# EAGLE schematic design (EAGLE 9.5.2)
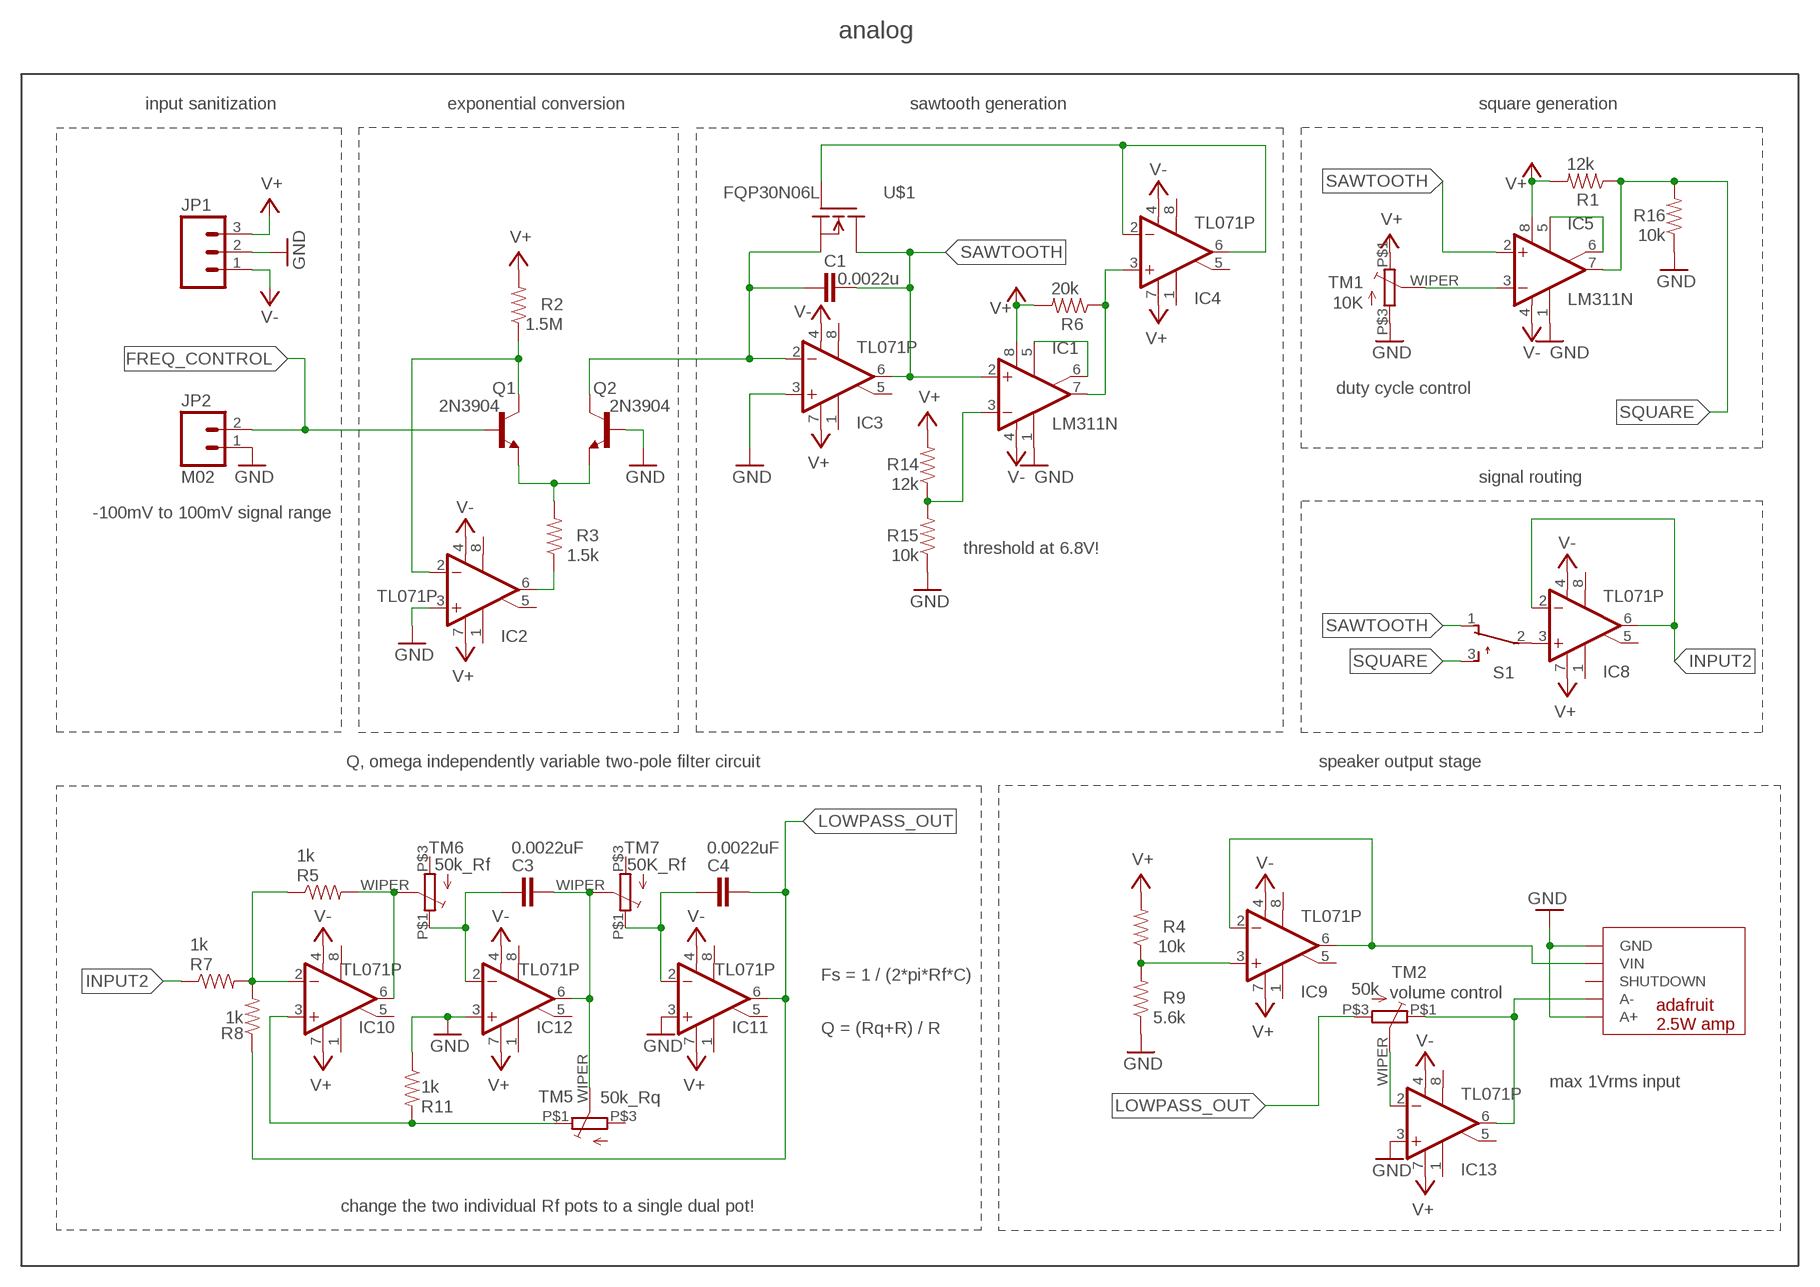
[diagram p0: schematic, sheet 1]

## Parts
C1  0.0022u  CAPCAP_WIMA  [3872_WIMA_CAP]
C3  0.0022uF  CAPPTH1  [CAP-PTH-5MM]
C4  0.0022uF  CAPPTH1  [CAP-PTH-5MM]
IC1  LM311N  [DIL08]
IC2  TL071P  [DIL08]
IC3  TL071P  [DIL08]
IC4  TL071P  [DIL08]
IC5  LM311N  [DIL08]
IC8  TL071P  [DIL08]
IC9  TL071P  [DIL08]
IC10  TL071P  [DIL08]
IC11  TL071P  [DIL08]
IC12  TL071P  [DIL08]
IC13  TL071P  [DIL08]
JP1  M03  [1X03]
JP2  M02  [1X02]
Q1  2N3904  [TO92]
Q2  2N3904  [TO92]
R1  12k  RESISTORAXIAL-0.3  [AXIAL-0.3]
R2  1.5M  RESISTORAXIAL-0.3  [AXIAL-0.3]
R3  1.5k  RESISTORAXIAL-0.3  [AXIAL-0.3]
R4  10k  RESISTORAXIAL-0.3  [AXIAL-0.3]
R5  1k  RESISTORAXIAL-0.3  [AXIAL-0.3]
R6  20k  RESISTORAXIAL-0.3  [AXIAL-0.3]
R7  1k  RESISTORAXIAL-0.3  [AXIAL-0.3]
R8  1k  RESISTORAXIAL-0.3  [AXIAL-0.3]
R9  5.6k  RESISTORAXIAL-0.3  [AXIAL-0.3]
R11  1k  RESISTORAXIAL-0.3  [AXIAL-0.3]
R14  12k  RESISTORAXIAL-0.3  [AXIAL-0.3]
R15  10k  RESISTORAXIAL-0.3  [AXIAL-0.3]
R16  10k  RESISTORAXIAL-0.3  [AXIAL-0.3]
S1  TL32PO  [TL3XPO]
TM1  10K  TRIMPOT  [3386_TRI]
TM2  50k  TRIMPOT  [3386_TRI]
TM5  50k_Rq  TRIMPOT  [3386_TRI]
TM6  50k_Rf  TRIMPOT  [3386_TRI]
TM7  50K_Rf  TRIMPOT  [3386_TRI]
U$1  FQP30N06L  [TO-220]
U$2  PAM8302A_ADAFRUIT  [PAM8302A_ADAFRUIT]

## Nets
11.5V: IC9.3(+IN) R4.P$1 R9.P$2
BANDPASS_OUT: C3.1 IC12.6(OUT) TM5.WIPER(S) TM7.WIPER(S)
FREQ_CONTROL: JP2.2 Q1.2(B)
GND: IC1.1(GND) IC2.3(+IN) IC3.3(+IN) IC5.1(GND) IC11.3(+IN) IC12.3(+IN) IC13.3(+IN) JP1.2 JP2.1 Q2.2(B) R9.P$1 R11.P$1 R15.P$1 R16.P$1 TM1.P$3(A) U$2.A+ U$2.GND
HIGHPASS_OUT: IC10.6(OUT) R5.P$2 TM6.WIPER(S)
INPUT2: IC8.2(-IN) IC8.6(OUT) R7.P$1
LOWPASS_OUT: C4.1 IC11.6(OUT) R8.P$1 TM2.P$3(A)
N$1: IC5.3(-IN) TM1.WIPER(S)
N$2: Q1.3(E) Q2.3(E) R3.P$2
N$4: IC13.2(-IN) TM2.WIPER(S)
N$5: IC2.6(OUT) R3.P$1
N$6: IC1.7(OUT) IC4.3(+IN) R6.P$1
N$7: C1.P$1 IC3.2(-IN) Q2.1(C) U$1.3(S)
N$9: IC1.5(ON) IC1.6(ON/STR)
N$10: IC4.2(-IN) IC4.6(OUT) U$1.1(G)
N$11: IC5.5(ON) IC5.6(ON/STR)
N$12: IC2.2(-IN) Q1.1(C) R2.P$1
N$18: IC10.2(-IN) R5.P$1 R7.P$2 R8.P$2
N$19: IC13.6(OUT) TM2.P$1(E) U$2.A-
N$20: C3.2 IC12.2(-IN) TM6.P$1(E)
N$22: C4.2 IC11.2(-IN) TM7.P$1(E)
N$24: IC1.3(-IN) R14.P$1 R15.P$2
N$25: IC10.3(+IN) R11.P$2 TM5.P$1(E)
PRE_FILTER: IC8.3(+IN) S1.2(P)
SAWTOOTH: C1.P$5 IC1.2(+IN) IC3.6(OUT) IC5.2(+IN) S1.1(O) U$1.2(D)
SQUARE: IC5.7(OUT) R1.P$1 R16.P$2 S1.3(S)
V+: IC1.8(V+) IC2.7(V+) IC3.7(V+) IC4.7(V+) IC5.8(V+) IC8.7(V+) IC9.7(V+) IC10.7(V+) IC11.7(V+) IC12.7(V+) IC13.7(V+) JP1.3 R1.P$2 R2.P$2 R4.P$2 R6.P$2 R14.P$2 TM1.P$1(E)
V-: IC1.4(V-) IC2.4(V-) IC3.4(V-) IC4.4(V-) IC5.4(V-) IC8.4(V-) IC9.4(V-) IC10.4(V-) IC11.4(V-) IC12.4(V-) IC13.4(V-) JP1.1
VCC_LM386: IC9.2(-IN) IC9.6(OUT) U$2.VIN
Unconnected: IC2.1(ON1) IC2.5(ON2) IC2.8(OPT) IC3.1(ON1) IC3.5(ON2) IC3.8(OPT) IC4.1(ON1) IC4.5(ON2) IC4.8(OPT) IC8.1(ON1) IC8.5(ON2) IC8.8(OPT) IC9.1(ON1) IC9.5(ON2) IC9.8(OPT) IC10.1(ON1) IC10.5(ON2) IC10.8(OPT) IC11.1(ON1) IC11.5(ON2) IC11.8(OPT) IC12.1(ON1) IC12.5(ON2) IC12.8(OPT) IC13.1(ON1) IC13.5(ON2) IC13.8(OPT) TM5.P$3(A) TM6.P$3(A) TM7.P$3(A) U$2.SD(SHUTDOWN)

## Notes on the sheet
- analog
- input sanitization | exponential conversion | sawtooth generation | square generation
- duty cycle control
- signal routing
- -100mV to 100mV signal range
- threshold at 6.8V!
- Q, omega independently variable two-pole filter circuit | speaker output stage
- Fs = 1 / (2*pi*Rf*C)
- volume control
- Q = (Rq+R) / R
- max 1Vrms input
- change the two individual Rf pots to a single dual pot!

## Library data of the parts
C1 C3 C4 = HyTechDevices:CAP: Capacitor Standard 0603 ceramic capacitor, and 0.1" leaded capacitor.
IC1 IC5 = linear:LM311: COMPARATOR
IC2-IC4 IC8-IC13 = linear:TL071: OP AMP
JP1 = HyTechDevices:M03: Standard 3-pin 0.1" header.
JP2 = HyTechDevices:M02: Standard 2-pin 0.1" header. NOTES ON THE VARIANTS LOCK and LOCK_LONGPADS... This footprint was designed to help hold the alignment of a through-hole component (i.e. 6-pin header) while soldering it into place. You may notice that each hole has been shifted either up or down by 0.005 of an inch from it's more standard position (which is a perfectly straight line). This slight alteration caused the pins (the squares in the middle) to touch the edges of the holes. Because they are alternating, it causes a "brace" to hold the component in place. 0.005 has proven to be the perfect amount of "off-center" position when using our standard breakaway headers. Although looks a little odd when you look at the bare footprint, once you have a header in there, the alteration is very hard to notice. Also,if you push a header all the way into place, it is covered up entirely on the bottom side. This idea of altering the position of holes to aid alignment will be further integrated into the Sparkfun Library for other footprints. It can help hold any component with 3 or more connection pins. Note: The Sparkfun version includes many other packages including surface mount that may be of future interest. Source: Sparkfun <https://github.com/sparkfun/SparkFun-Eagle-Libraries>
Q1 Q2 = transistor:2N3904: NPN TRANSISTOR
R1-R9 R11 R14-R16 = HyTechDevices:RESISTOR: Resistor Basic schematic elements and footprints for 0603, 1206, and PTH resistors.
S1 = switch:TL32PO: TINY SWITCH ON - MOM Source: http://www2.produktinfo.conrad.com/datenblaetter/700000-724999/705152-da-01-de-Subminiaturschalter_TL_36YO.pdf
TM1 TM2 TM5-TM7 = HyTechDevices:TRIMPOT: SMT trimmer potentiometer part number TC33X http://www.ladyada.net/library/eagle
U$1 = HyTechDevices:FQP30N06L
U$2 = HyTechDevices:PAM8302A_ADAFRUIT